# Altium schematic sheet LEDs.SchDoc
size A
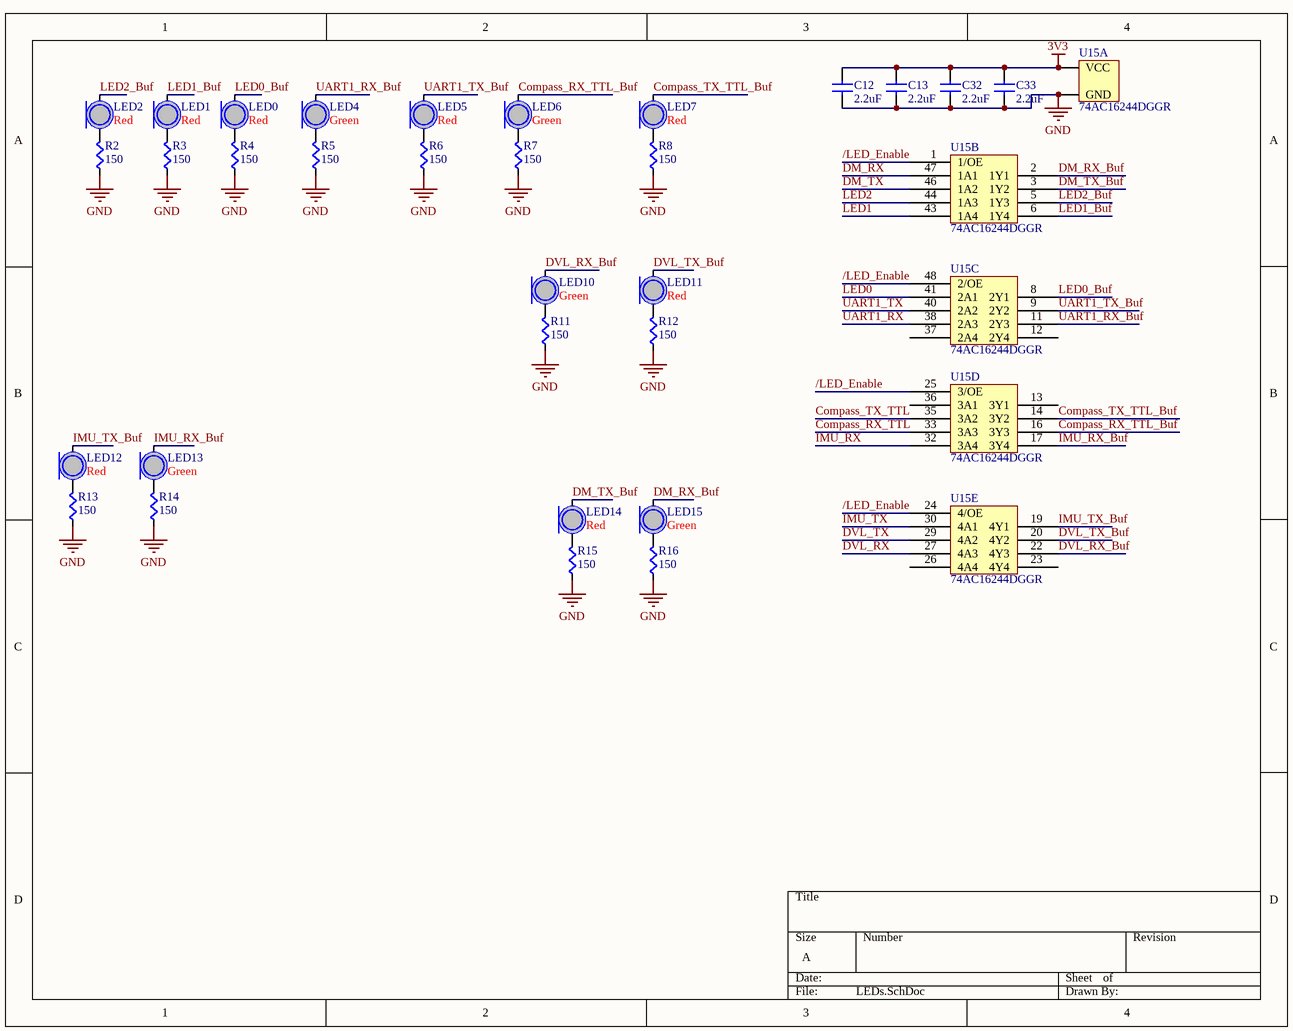
[diagram p0: LEDs.SchDoc]

## Parts
C12  value 2.2uF  [CAPC0603]  (hidden comment: Cap)
C13  value 2.2uF  [CAPC0603]  (hidden comment: Cap)
C32  value 2.2uF  [CAPC0603]  (hidden comment: Cap)
C33  value 2.2uF  [CAPC0603]  (hidden comment: Cap)
LED0  Color: Red  [LED0603]  (hidden comment: LED)
LED1  Color: Red  [LED0603]  (hidden comment: LED)
LED2  Color: Red  [LED0603]  (hidden comment: LED)
LED4  Color: Green  [LED0603]  (hidden comment: LED)
LED5  Color: Red  [LED0603]  (hidden comment: LED)
LED6  Color: Green  [LED0603]  (hidden comment: LED)
LED7  Color: Red  [LED0603]  (hidden comment: LED)
LED10  Color: Green  [LED0603]  (hidden comment: LED)
LED11  Color: Red  [LED0603]  (hidden comment: LED)
LED12  Color: Red  [LED0603]  (hidden comment: LED)
LED13  Color: Green  [LED0603]  (hidden comment: LED)
LED14  Color: Red  [LED0603]  (hidden comment: LED)
LED15  Color: Green  [LED0603]  (hidden comment: LED)
R2  value 150  [RES0603]  (hidden comment: Res)
R3  value 150  [RES0603]  (hidden comment: Res)
R4  value 150  [RES0603]  (hidden comment: Res)
R5  value 150  [RES0603]  (hidden comment: Res)
R6  value 150  [RES0603]  (hidden comment: Res)
R7  value 150  [RES0603]  (hidden comment: Res)
R8  value 150  [RES0603]  (hidden comment: Res)
R11  value 150  [RES0603]  (hidden comment: Res)
R12  value 150  [RES0603]  (hidden comment: Res)
R13  value 150  [RES0603]  (hidden comment: Res)
R14  value 150  [RES0603]  (hidden comment: Res)
R15  value 150  [RES0603]  (hidden comment: Res)
R16  value 150  [RES0603]  (hidden comment: Res)
U15  74AC16244DGGR  (parts A,B,C,D,E of 5)

## Nets
3V3: C12.1(A) C13.1(A) C32.1(A) C33.1(A) U15.VCC
GND: C12.2(B) C13.2(B) C32.2(B) C33.2(B) R2.2(B) R3.2(B) R4.2(B) R5.2(B) R6.2(B) R7.2(B) R8.2(B) R11.2(B) R12.2(B) R13.2(B) R14.2(B) R15.2(B) R16.2(B) U15.GND
/LED_Enable: U15.1(1/OE) U15.24(4/OE) U15.25(3/OE) U15.48(2/OE)
Compass_RX_TTL: U15.33(3A3)
Compass_RX_TTL_Buf: LED6.A U15.16(3Y3)
Compass_TX_TTL: U15.35(3A2)
Compass_TX_TTL_Buf: LED7.A U15.14(3Y2)
DM_RX: U15.47(1A1)
DM_RX_Buf: LED15.A U15.2(1Y1)
DM_TX: U15.46(1A2)
DM_TX_Buf: LED14.A U15.3(1Y2)
DVL_RX: U15.27(4A3)
DVL_RX_Buf: LED10.A U15.22(4Y3)
DVL_TX: U15.29(4A2)
DVL_TX_Buf: LED11.A U15.20(4Y2)
IMU_RX: U15.32(3A4)
IMU_RX_Buf: LED13.A U15.17(3Y4)
IMU_TX: U15.30(4A1)
IMU_TX_Buf: LED12.A U15.19(4Y1)
LED0: U15.41(2A1)
LED0_Buf: LED0.A U15.8(2Y1)
LED1: U15.43(1A4)
LED1_Buf: LED1.A U15.6(1Y4)
LED2: U15.44(1A3)
LED2_Buf: LED2.A U15.5(1Y3)
UART1_RX: U15.38(2A3)
UART1_RX_Buf: LED4.A U15.11(2Y3)
UART1_TX: U15.40(2A2)
UART1_TX_Buf: LED5.A U15.9(2Y2)
NetLED0_C: LED0.C R4.1(A)
NetLED1_C: LED1.C R3.1(A)
NetLED2_C: LED2.C R2.1(A)
NetLED4_C: LED4.C R5.1(A)
NetLED5_C: LED5.C R6.1(A)
NetLED6_C: LED6.C R7.1(A)
NetLED7_C: LED7.C R8.1(A)
NetLED10_C: LED10.C R11.1(A)
NetLED11_C: LED11.C R12.1(A)
NetLED12_C: LED12.C R13.1(A)
NetLED13_C: LED13.C R14.1(A)
NetLED14_C: LED14.C R15.1(A)
NetLED15_C: LED15.C R16.1(A)

Not connected (* = marked no-connect by the designer): U15 12(2Y4) 13(3Y1) 23(4Y4) 26(4A4) 36(3A1) 37(2A4)

## Library data of the parts
U15 = 74AC16244DGGR: IC BUFF/DVR TRI-ST 16BIT 48TSSOP; Supplier 1: Digi-Key; Supplier Part Number 1: 296-15845-1-ND
C12 C13 C32 C33 = Cap: Supplier 1: Digi-Key; Supplier Part Number 1: 587-1254-1-ND
LED0-LED2 LED4-LED7 LED10-LED15 = LED: Supplier 1: Digi-Key
  LED0-LED2 LED5 LED7 LED11 LED12 LED14: Supplier Part Number 1: 754-1122-1-ND
  LED4 LED6 LED10 LED13 LED15: Supplier Part Number 1: 160-1446-1-ND
R2-R8 R11-R16 = Res: Supplier 1: Digi-Key; Supplier Part Number 1: RHM150CFCT-ND